# EAGLE design zif socket (EAGLE 7.6.0)
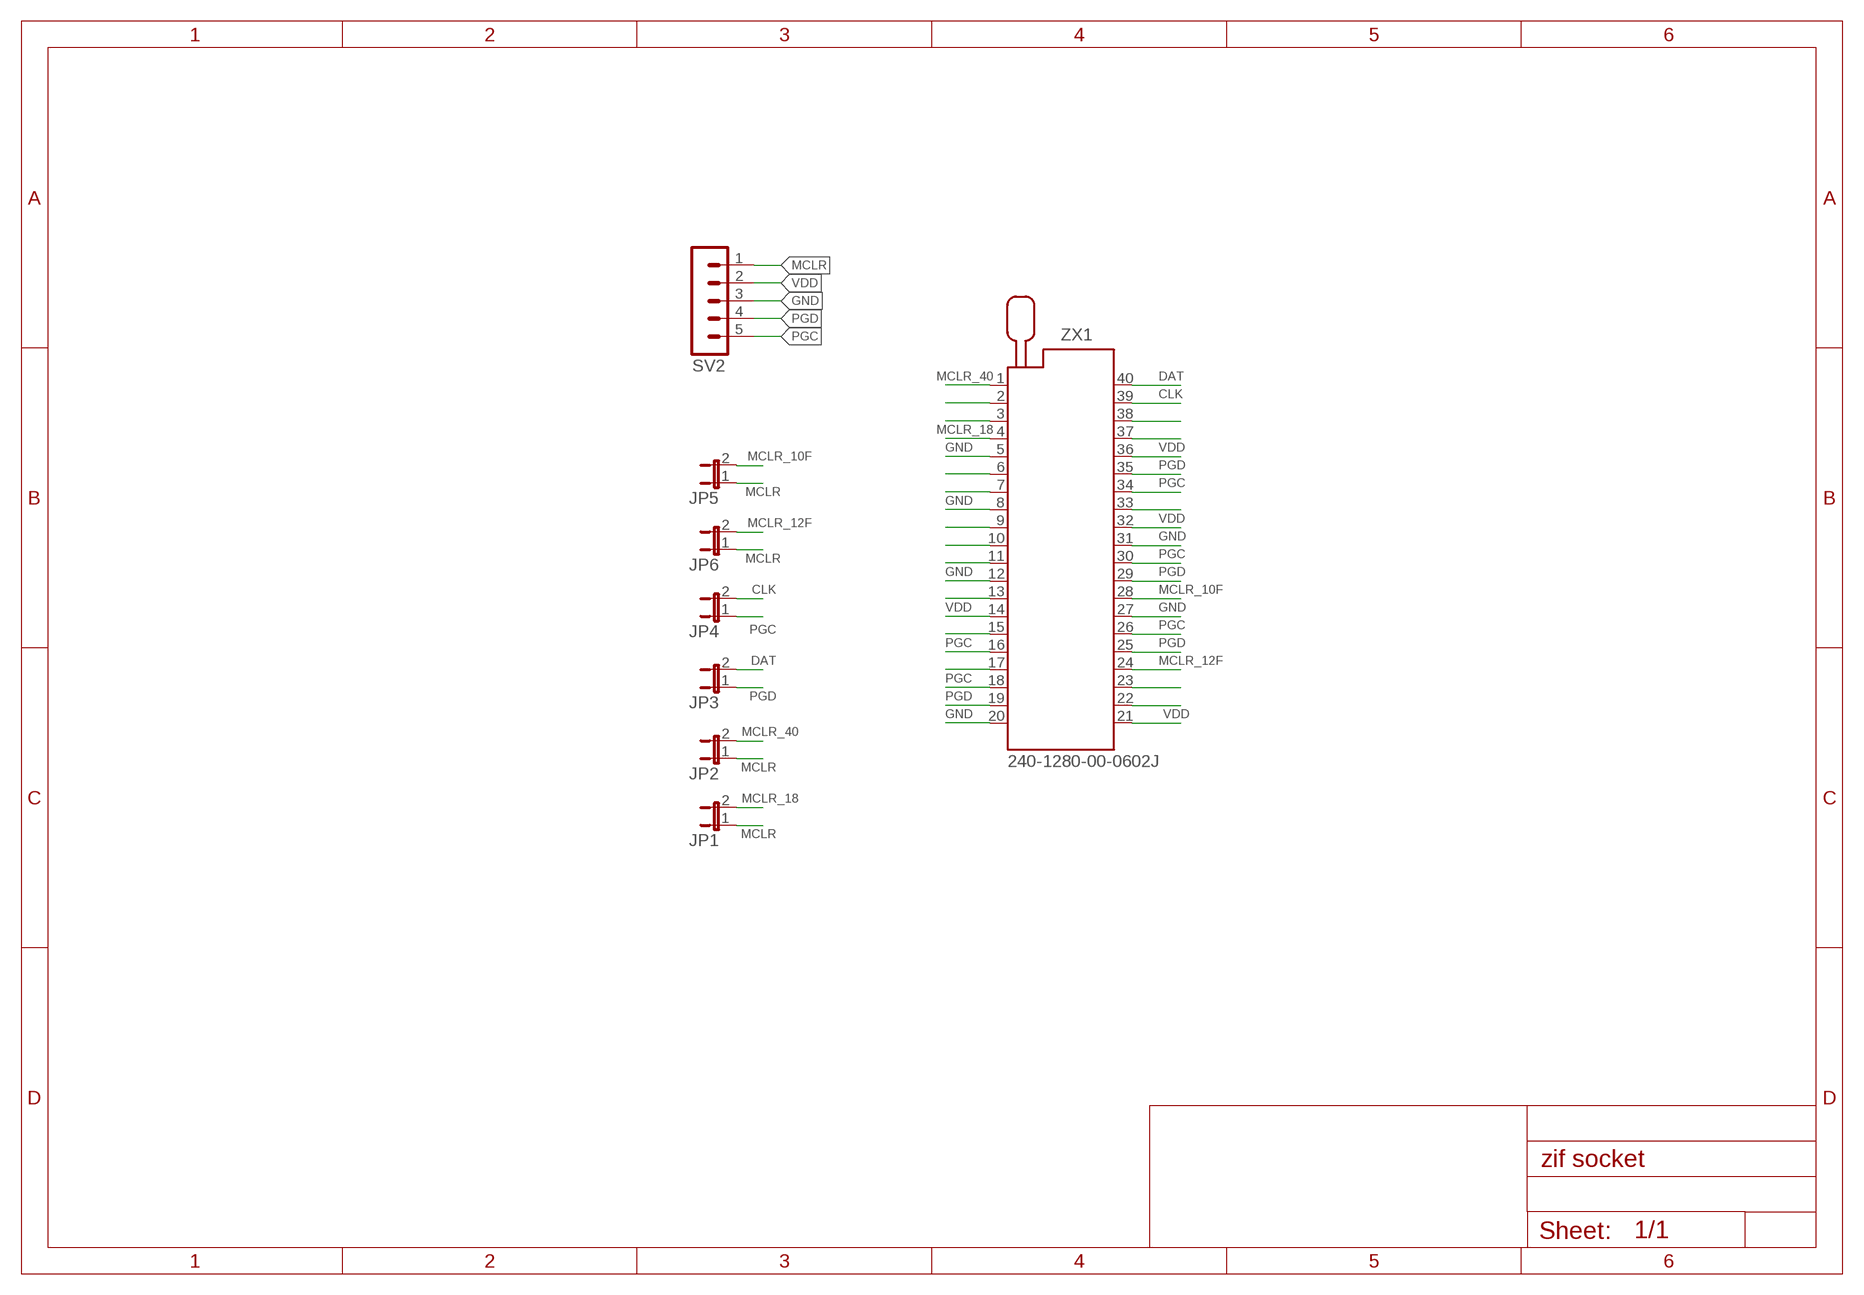
[diagram p0: schematic, sheet 1]

## Parts
JP1  JP1E  [JP1]
JP2  JP1E  [JP1]
JP3  JP1E  [JP1]
JP4  JP1E  [JP1]
JP5  JP1E  [JP1]
JP6  JP1E  [JP1]
SV2  MA05-1  [MA05-1]
ZX1  240-1280-00-0602J  [240-1280-00-0602J]

## Nets
CLK: JP4.2 ZX1.39
DAT: JP3.2 ZX1.40
GND: SV2.3 ZX1.5 ZX1.8 ZX1.12 ZX1.20 ZX1.27 ZX1.31
MCLR: JP1.1 JP2.1 JP5.1 JP6.1 SV2.1
MCLR_10F: JP5.2 ZX1.28
MCLR_12F: JP6.2 ZX1.24
MCLR_18: JP1.2 ZX1.4
MCLR_40: JP2.2 ZX1.1
N$3: ZX1.2
N$17: ZX1.3
N$20: ZX1.6
N$21: ZX1.7
N$23: ZX1.9
N$24: ZX1.10
N$25: ZX1.11
N$26: ZX1.13
N$29: ZX1.15
N$31: ZX1.17
N$36: ZX1.22
N$37: ZX1.23
N$45: ZX1.33
N$49: ZX1.37
N$50: ZX1.38
PGC: JP4.1 SV2.5 ZX1.16 ZX1.18 ZX1.26 ZX1.30 ZX1.34
PGD: JP3.1 SV2.4 ZX1.19 ZX1.25 ZX1.29 ZX1.35
VDD: SV2.2 ZX1.14 ZX1.21 ZX1.32 ZX1.36

## Library data of the parts
JP1-JP6 = jumper:JP1E: JUMPER
SV2 = con-lstb:MA05-1: PIN HEADER; OC_FARNELL: unknown; OC_NEWARK: unknown
ZX1 = con-3m:240-?-00-0602J: Zero Insertion Force Socked Source: http://www.3M.com/ehpd

## Board
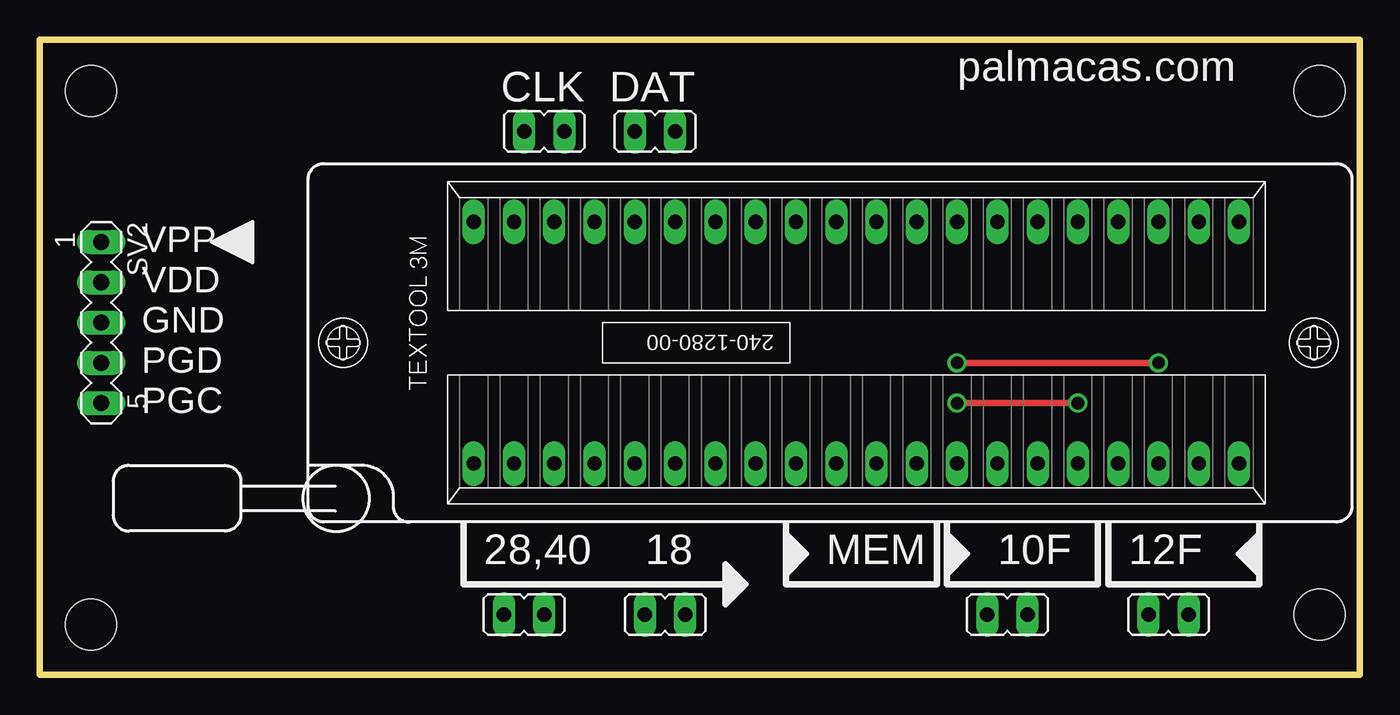
[diagram p1: board, top side]
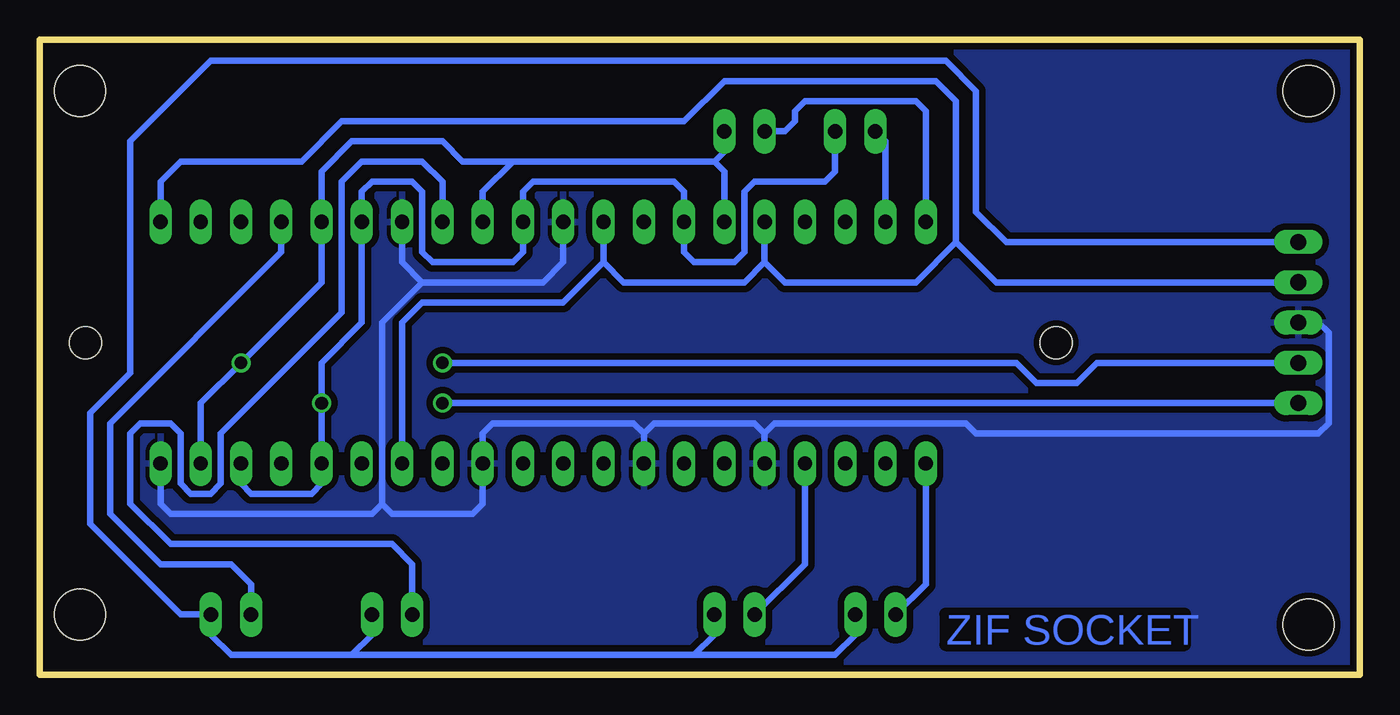
[diagram p2: board, bottom side, seen from below]

Size 83.25 x 40.08 mm. Coordinates in mm from the lower left corner, seen from the top.
Outline: 83.25,0 83.25,40.08 0,40.08 0,0 83.25,0
Copper layers (1*16): Top 0.035mm / dielectric 1.5mm / Bottom 0.035mm
Design rules "default": minimum track width 6mil, minimum drill 12mil, track to track 6mil, track to pad 6mil, pad to pad 6mil, via to via 6mil, smd to smd 0mil, copper to edge 10mil, drill to drill 10mil, minimum pad ring 10mil, minimum via ring 6mil, stop-mask expansion 2mil, vias tented up to drill 100mil, thermal gap 10mil
Holes 3.2 mm at 3.24,3.17 3.24,36.83 80.71,3.81 80.71,36.83

### Footprints (pad centres in the part's own frame; a part is rotated, then mirrored left to right if it is on the bottom)
JP1 = drill 0.914 long: 1 0,-1.27; 2 0,1.27
MA05-1 = drill 1.016 long: 1 -5.08,0; 2 -2.54,0; 3 0,0; 4 2.54,0; 5 5.08,0
240-1280-00-0602J = drill 0.9 long: 1 -24.13,-7.62; 2 -21.59,-7.62; 3 -19.05,-7.62; 4 -16.51,-7.62; 5 -13.97,-7.62; 6 -11.43,-7.62; 7 -8.89,-7.62; 8 -6.35,-7.62; 9 -3.81,-7.62; 10 -1.27,-7.62; 11 1.27,-7.62; 12 3.81,-7.62; 13 6.35,-7.62; 14 8.89,-7.62; 15 11.43,-7.62; 16 13.97,-7.62; 17 16.51,-7.62; 18 19.05,-7.62; 19 21.59,-7.62; 20 24.13,-7.62; 21 24.13,7.62; 22 21.59,7.62; 23 19.05,7.62; 24 16.51,7.62; 25 13.97,7.62; 26 11.43,7.62; 27 8.89,7.62; 28 6.35,7.62; 29 3.81,7.62; 30 1.27,7.62; 31 -1.27,7.62; 32 -3.81,7.62; 33 -6.35,7.62; 34 -8.89,7.62; 35 -11.43,7.62; 36 -13.97,7.62; 37 -16.51,7.62; 38 -19.05,7.62; 39 -21.59,7.62; 40 -24.13,7.62 | hole 2: 28.86,0; -32.36,0

### Placement (x,y rotation side)
JP1  39.44,3.81 90 top
JP2  30.55,3.81 90 top
JP3  38.8,34.29 90 top
JP4  31.82,34.29 90 top
JP5  61.03,3.81 90 top
JP6  71.19,3.81 90 top
SV2  3.88,22.23 270 top
ZX1  51.51,20.95 0 top

### Tracks (layer width: path | path; a pad name or v marks a point on that pad's centre or on a via)
CLK
  Bottom 0.406: ZX1.39 29.91,33.66 JP4.2
DAT
  Bottom 0.406: JP3.2 36.27,34.29 35.63,34.92 35.63,35.56 34.99,36.2 28.01,36.2 27.38,35.56 ZX1.40
GND
  Bottom 0.406: ZX1.31 50.23,26.04 51.51,24.77 59.12,24.77 | 61.66,10.79 61.03,10.16 55.95,10.16 55.31,10.79 ZX1.12 55.31,15.24 54.68,15.88 45.79,15.88 45.16,15.24 | ZX1.27 60.4,26.04 59.12,24.77 | ZX1.20 75.63,10.79 75,10.16 62.3,10.16 61.66,10.79 | 61.66,10.79 61.66,22.23 59.12,24.77 | SV2.3 2.61,22.23 1.98,21.59 1.98,15.88 2.61,15.24 24.2,15.24 24.84,15.88 36.9,15.88 37.54,15.24 | 37.54,15.24 ZX1.5 | 45.16,15.24 ZX1.8 | 45.16,15.24 44.52,15.88 38.17,15.88 37.54,15.24
  pour Bottom (isolate 0.406): -0.09,40.01 83.25,40.01 83.25,0 0.07,0
MCLR
  Bottom 0.406: JP1.1 40.71,2.54 41.98,1.27 | 41.98,1.27 33.09,1.27 31.82,2.54 JP2.1 | 63.57,1.27 71.19,1.27 72.46,2.54 JP6.1 74.36,3.81 80.08,9.53 80.08,16.51 77.54,19.05 77.54,33.66 72.46,38.73 26.11,38.73 24.2,36.83 24.2,29.21 22.3,27.3 SV2.1 | 63.57,1.27 41.98,1.27 | JP5.1 62.3,2.54 63.57,1.27
MCLR_10F
  Bottom 0.406: ZX1.28 57.85,31.11 59.12,32.38 62.94,32.38 64.2,31.11 64.2,22.86 71.82,15.24 71.82,12.06 72.46,11.43 73.73,11.43 74.36,12.06 74.36,15.24 75,15.88 76.9,15.88 77.54,15.24 77.54,10.79 75,8.26 61.03,8.26 59.76,6.99 JP5.2
MCLR_12F
  Bottom 0.406: JP6.2 69.92,5.71 71.19,6.99 75.63,6.99 78.81,10.16 78.81,15.88 68.01,26.67 ZX1.24
MCLR_18
  Bottom 0.406: JP1.2 34.99,6.99 ZX1.4 34.99,13.97
MCLR_40
  Bottom 0.406: JP2.2 27.38,5.71 ZX1.1
PGC  (via drill 0.8)
  Top 0.406: v57.85,17.14 v65.47,17.14
  Bottom 0.406: ZX1.18 70.55,12.06 69.92,11.43 66.11,11.43 65.47,12.06 ZX1.16 v65.47,17.14 65.47,19.68 62.94,22.23 ZX1.26 62.94,30.48 62.3,31.11 59.76,31.11 59.12,30.48 59.12,26.67 58.49,26.04 53.41,26.04 52.77,26.67 ZX1.30 52.77,30.48 52.14,31.11 43.25,31.11 42.62,30.48 ZX1.34 42.62,26.67 41.98,26.04 39.44,26.04 38.8,26.67 38.8,30.48 38.17,31.11 33.73,31.11 33.09,31.75 JP4.1 | SV2.5 v57.85,17.14
PGD  (via drill 0.8)
  Top 0.406: v57.85,19.68 v70.55,19.68
  Bottom 0.406: ZX1.29 55.31,30.48 53.41,32.38 | ZX1.19 73.09,17.14 v70.55,19.68 65.47,24.77 ZX1.25 65.47,31.75 63.57,33.66 57.85,33.66 56.59,32.38 53.41,32.38 | ZX1.35 40.08,31.75 40.71,32.38 | 53.41,32.38 40.71,32.38 | JP3.1 40.08,33.02 40.71,32.38 | SV2.4 16.58,19.68 17.85,18.41 20.39,18.41 21.66,19.68 v57.85,19.68
VDD
  Bottom 0.406: ZX1.21 75.63,31.11 74.36,32.38 66.74,32.38 64.2,34.92 42.62,34.92 40.08,37.47 26.74,37.47 25.47,36.2 25.47,27.3 | 37.54,26.04 ZX1.36 | 37.54,26.04 38.8,24.77 46.42,24.77 47.7,26.04 | 37.54,26.04 36.27,24.77 28.01,24.77 25.47,27.3 | 25.47,27.3 22.93,24.77 SV2.2 | 47.7,26.04 ZX1.32 | 47.7,26.04 50.23,23.5 59.12,23.5 60.4,22.23 ZX1.14

### Text on the board
Bottom: ZIF SOCKET
tPlace: CLK | DAT | palmacas.com | VPP | VDD | GND | PGD | PGC | 28,40 | 18 | MEM | 10F | 12F